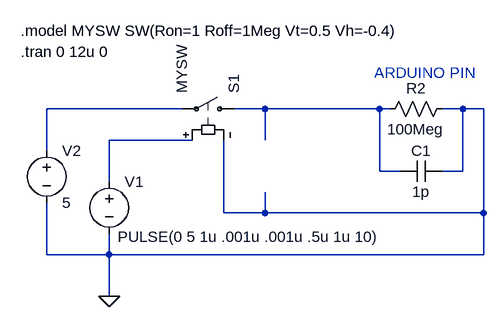
[diagram p0: schematic Pull_Down.asc]
Pull_Down.asc, the LTspice schematic file:
Version 4
SHEET 1 880 680
WIRE 176 192 -32 192
WIRE 304 192 256 192
WIRE 480 192 304 192
WIRE 496 192 480 192
WIRE 608 192 576 192
WIRE 640 192 608 192
WIRE 192 240 64 240
WIRE 304 240 304 192
WIRE -32 256 -32 192
WIRE 480 288 480 192
WIRE 512 288 480 288
WIRE 608 288 608 192
WIRE 608 288 576 288
WIRE 64 304 64 240
WIRE 240 352 240 240
WIRE 304 352 304 320
WIRE 304 352 240 352
WIRE 640 352 640 192
WIRE 640 352 304 352
WIRE -32 416 -32 336
WIRE 64 416 64 384
WIRE 64 416 -32 416
WIRE 640 416 640 352
WIRE 640 416 64 416
WIRE 64 480 64 416
FLAG 64 480 0
SYMBOL voltage 64 288 R0
WINDOW 3 13 101 Left 2
SYMATTR InstName V1
SYMATTR Value PULSE(0 5 1u .001u .001u .5u 1u 10)
SYMBOL res 592 176 R90
WINDOW 0 0 56 VBottom 2
WINDOW 3 32 56 VTop 2
SYMATTR InstName R2
SYMATTR Value 100Meg
SYMBOL sw 272 192 M270
SYMATTR InstName S1
SYMATTR Value MYSW
SYMBOL voltage -32 240 R0
SYMATTR InstName V2
SYMATTR Value 5
SYMBOL cap 576 272 R90
WINDOW 0 0 32 VBottom 2
WINDOW 3 32 32 VTop 2
SYMATTR InstName C1
SYMATTR Value 1p
TEXT -72 104 Left 2 !.tran 0 12u 0
TEXT -72 72 Left 2 !.model MYSW SW(Ron=1 Roff=1Meg Vt=0.5 Vh=-0.4)
TEXT 472 136 Left 2 ;ARDUINO PIN

The netlist it stands for:
* Pull_Down.asc
V1 N003 0 PULSE(0 5 1u .001u .001u .5u 1u 10)
R2 0 N002 100Meg
S1 N002 N001 N003 0 MYSW
V2 N001 0 5
C1 0 N002 1p
.tran 0 12u 0
.model MYSW SW(Ron=1 Roff=1Meg Vt=0.5 Vh=-0.4)
* ARDUINO PIN
.backanno
.end